# EasyEDA Pro project ProPrj_FireWheels_2025-05-12.epro, board PCB3
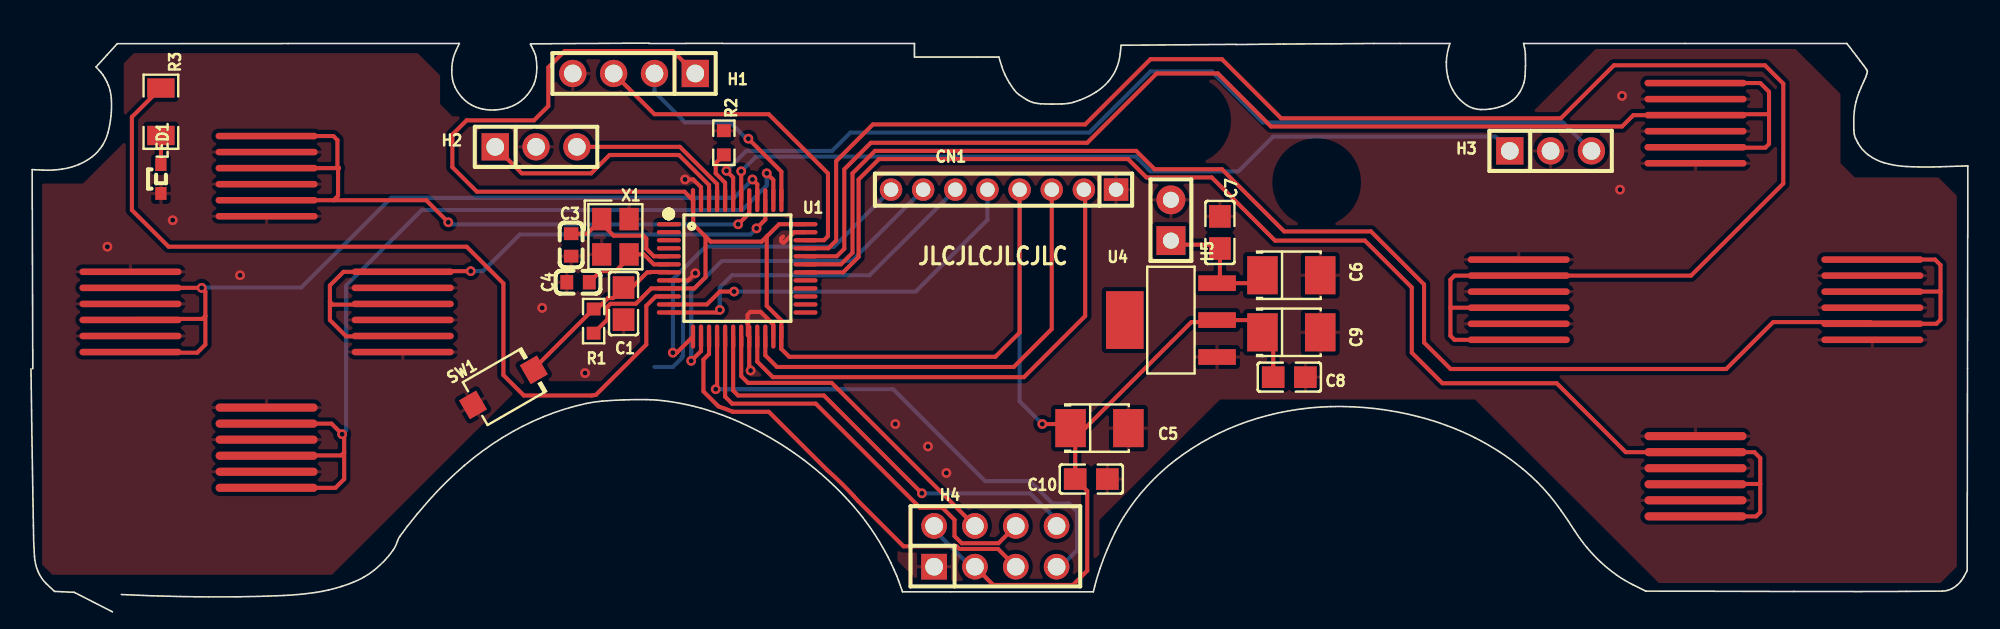
[diagram p5: board, top side]
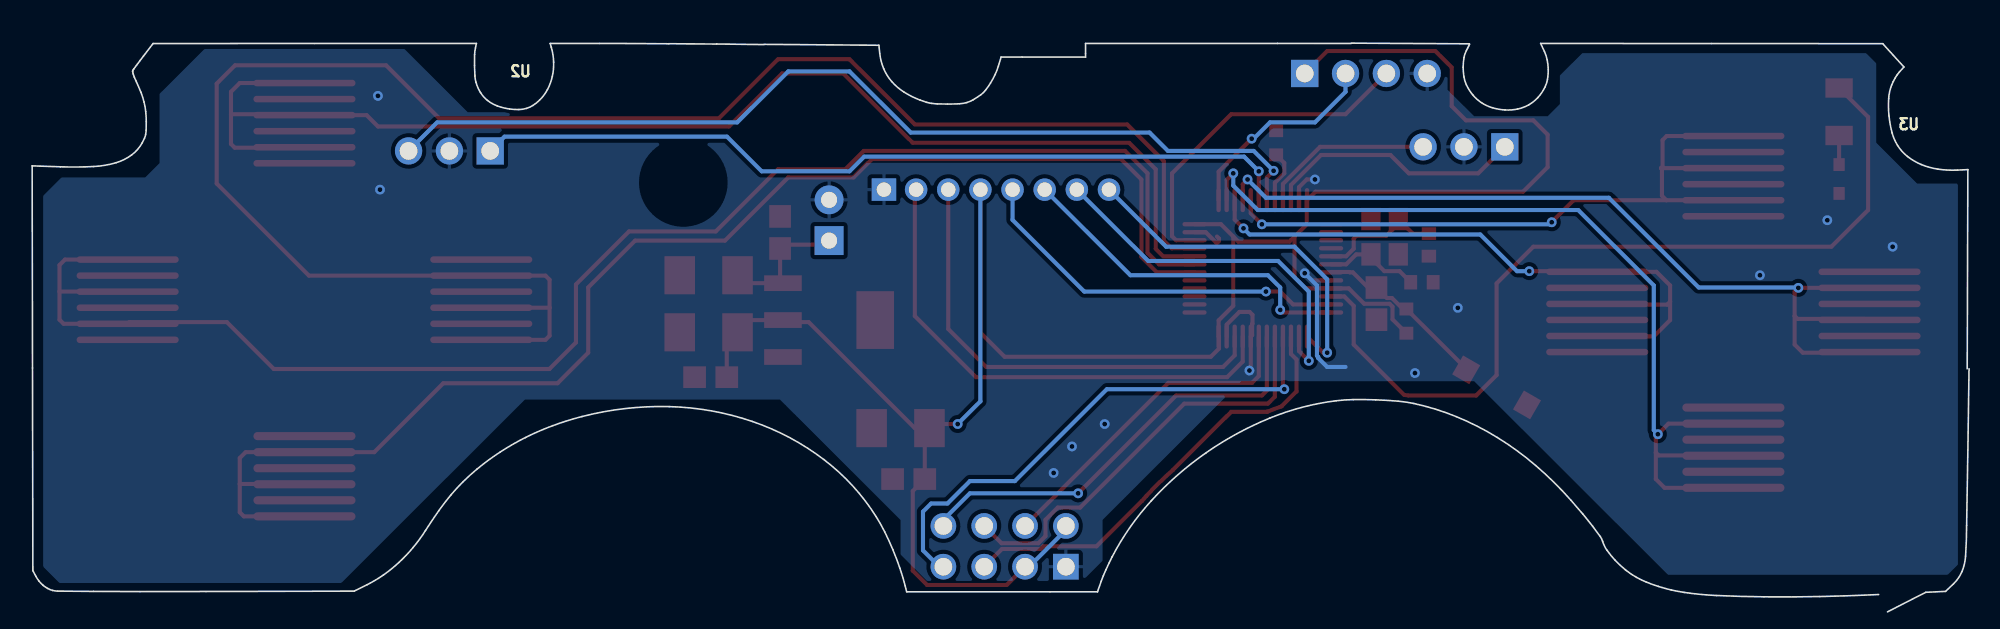
[diagram p6: board, bottom side, seen from below]

Outline 120.43 x 34.49 mm; copper layers: Top Layer, Bottom Layer. Coordinates in mm from the lower left corner of the outline.
Stack: Top Layer 0.035mm / Dielectric1 1.51mm FR4 er 4.5 / Bottom Layer 0.035mm

## Design rules (mm)
template: JLCPCB Capability(Two Layers Board)
spacing copperThickness1oz (default): track to track 0.102, other pairs 0.152 to 0.3
spacing copperThickness2oz: track to track 0.203, other pairs 0.152 to 0.3
track width copperThickness1oz (default): min 0.127, default 0.254, max 2.54
track width copperThickness2oz: min 0.203, default 0.254, max 2.54
differential pair differentialPair (default): width min 0.127, default 0.254, max 2.54; gap min 0.152, default 0.152
via viaSize (default): diameter min 0.5, default 0.61, max 10; hole min 0.3, default 0.305, max 6.3

## Placement (name value [footprint] x y rotation side)
C1  100nF  [C0805]  36.8 18.28 90 top
C3  20pF  [C0603]  33.53 21.93 90 top
C4  20pF  [C0603]  33.96 19.61 0 top
C5  22uF  [CAP-SMD_L3.5-W2.8-FD]  66.4 10.52 0 top
C6  22uF  [CAP-SMD_L3.5-W2.8-FD]  78.34 20.04 0 top
C7  100nF  [C0805]  73.9 22.71 270 top
C8  100nF  [C0805]  78.21 13.69 180 top
C9  22uF  [CAP-SMD_L3.5-W2.8-FD]  78.34 16.49 0 top
C10  100nF  [C0805]  65.89 7.34 0 top
CN1  HX PZ2.0-1x8P ZZ  [HDR-TH_8P-P2.00-V-M]  60.43 25.38 180 top
H1  -  [HDR-TH_4P-P2.54-V-M]  37.45 32.62 180 top
H2  -  [HDR-TH_3P-P2.54-V-M]  31.35 28.05 0 top
H3  -  [HDR-TH_3P-P2.54-V-M]  94.47 27.79 0 top
H4  -  [HDR-TH_8P-P2.54-V-F-R2-C4-S2.54-1]  59.93 3.15 0 top
H5  -  [HDR-TH_2P-P2.54-V-M-1]  70.85 23.47 90 top
LED1  27-21SURC/S530-A3/TR8  [LED-SMD_L1.7-W1.1-R-RD_RED]  8.01 26.04 90 top
R1  10kΩ  [R0603]  34.93 17.19 270 top
R2  10kΩ  [R0603]  43.03 28.3 270 top
R3  75Ω  [R1206]  8.01 30.23 270 top
SW1  -  [SW-SMD_L3.9-W3.0-P4.45]  29.32 13.06 30 top
U1  STM32F103C8T6  [LQFP-48_L7.0-W7.0-P0.50-LS9.0-BL]  43.86 20.47 270 top
U2  ABXY_Button_Pads  [ABXY_Button_Pads_MOD]  103.49 18.52 0 top
U3  DPAD_Button_Pads  [DPAD_Button_Pads_MOD]  14.59 17.76 0 top
U4  AMS1117-3.3  [SOT-223-3_L6.7-W3.7-P2.30-LS7.0-BR]  70.85 17.25 0 top
X1  8MHz  [CRYSTAL-SMD_4P-L3.2-W2.5-BL]  36.29 22.44 270 top

## Footprints (pads in the part's own frame, mm; a bottom-side part is the same pattern mirrored in y, then rotated)
ABXY_Button_Pads_MOD
  oval 6.35x0.508 smd: 1A(0,-8.5) 2A(0,-9.5) 3A(0,-10.5) 4A(0,-11.5) 5A(0,-12.5) 6A(0,-13.5)
  oval 6.35x0.406 smd: 1B(11,2.5) 1X(-11,2.5) 1Y(0,13.5) 2B(11,1.5) 2X(-11,1.5) 2Y(0,12.5) 3B(11,0.5) 3X(-11,0.5) 3Y(0,11.5) 4B(11,-0.5) 4X(-11,-0.5) 4Y(0,10.5) 5B(11,-1.5) 5X(-11,-1.5) 5Y(0,9.5) 6B(11,-2.5) 6X(-11,-2.5) 6Y(0,8.5)
C0603
  rect 0.8x0.9 smd: 1(-0.7,0) 2(0.7,0)
C0805
  rect 1.41x1.35 smd: 1(-1,0) 2(1,0)
CAP-SMD_L3.5-W2.8-FD
  rect 1.9x2.376 smd: 1(-1.798,0) 2(1.798,0)
CRYSTAL-SMD_4P-L3.2-W2.5-BL
  rect 1.4x1.2 smd: 1(-1.1,-0.85) 2(1.1,-0.85) 3(1.1,0.85) 4(-1.1,0.85)
DPAD_Button_Pads_MOD
  oval 6.35x0.508 smd: 1D(0,-5.96) 2D(0,-6.96) 3D(0,-7.96) 4D(0,-8.96) 5D(0,-9.96) 6D(0,-10.96)
  oval 6.35x0.406 smd: 1L(-8.47,2.5) 1R(8.47,2.5) 1U(0,10.96) 2L(-8.47,1.5) 2R(8.47,1.5) 2U(0,9.96) 3L(-8.47,0.5) 3R(8.47,0.5) 3U(0,8.96) 4L(-8.47,-0.5) 4R(8.47,-0.5) 4U(0,7.96) 5L(-8.47,-1.5) 5R(8.47,-1.5) 5U(0,6.96) 6L(-8.47,-2.5) 6R(8.47,-2.5) 6U(0,5.96)
HDR-TH_2P-P2.54-V-M-1
  rect 1.8x1.8 hole 1: 1(-1.27,0)
  round 1.8 hole 1: 2(1.27,0)
HDR-TH_3P-P2.54-V-M
  rect 1.7x1.7 hole 1.1: 1(-2.54,0)
  round 1.7 hole 1.1: 2(0,0) 3(2.54,0)
HDR-TH_4P-P2.54-V-M
  rect 1.7x1.7 hole 1.1: 1(-3.81,0)
  round 1.7 hole 1.1: 2(-1.27,0) 3(1.27,0) 4(3.81,0)
HDR-TH_8P-P2.00-V-M
  rect 1.524x1.4 hole 0.9: 1(-7,0)
  round 1.4 hole 0.9: 2(-5,0) 3(-3,0) 4(-1,0) 5(1,0) 6(3,0) 7(5,0) 8(7,0)
HDR-TH_8P-P2.54-V-F-R2-C4-S2.54-1
  rect 1.6x1.6 hole 1.1: 1(-3.81,-1.27)
  round 1.6 hole 1.1: 2(-3.81,1.27) 3(-1.27,-1.27) 4(-1.27,1.27) 5(1.27,-1.27) 6(1.27,1.27) 7(3.81,-1.27) 8(3.81,1.27)
LED-SMD_L1.7-W1.1-R-RD_RED
  rect 0.8x0.7 smd: 1(0.9,0) 2(-0.9,0)
LQFP-48_L7.0-W7.0-P0.50-LS9.0-BL
  oval 0.27x1.5 smd: 1(-2.75,-4.25) 2(-2.25,-4.25) 3(-1.75,-4.25) 4(-1.25,-4.25) 5(-0.75,-4.25) 6(-0.25,-4.25) 7(0.25,-4.25) 8(0.75,-4.25) 9(1.25,-4.25) 10(1.75,-4.25) 11(2.25,-4.25) 12(2.75,-4.25) 25(2.75,4.25) 26(2.25,4.25) 27(1.75,4.25) 28(1.25,4.25) 29(0.75,4.25) 30(0.25,4.25) 31(-0.25,4.25) 32(-0.75,4.25) 33(-1.25,4.25) 34(-1.75,4.25) 35(-2.25,4.25) 36(-2.75,4.25)
  oval 1.5x0.27 smd: 13(4.25,-2.75) 14(4.25,-2.25) 15(4.25,-1.75) 16(4.25,-1.25) 17(4.25,-0.75) 18(4.25,-0.25) 19(4.25,0.25) 20(4.25,0.75) 21(4.25,1.25) 22(4.25,1.75) 23(4.25,2.25) 24(4.25,2.75) 37(-4.25,2.75) 38(-4.25,2.25) 39(-4.25,1.75) 40(-4.25,1.25) 41(-4.25,0.75) 42(-4.25,0.25) 43(-4.25,-0.25) 44(-4.25,-0.75) 45(-4.25,-1.25) 46(-4.25,-1.75) 47(-4.25,-2.25) 48(-4.25,-2.75)
R0603
  rect 0.806x0.864 smd: 1(-0.753,0) 2(0.753,0)
R1206
  rect 1.208x1.701 smd: 1(-1.479,0) 2(1.479,0)
SOT-223-3_L6.7-W3.7-P2.30-LS7.0-BR
  rect 2.34x0.98 smd: 1(2.87,-2.3) 2(2.87,0) 3(2.87,2.3)
  rect 2.34x3.6 smd: 4(-2.87,0)
SW-SMD_L3.9-W3.0-P4.45
  rect 1.23x1.36 smd: 1(-2.185,0) 2(2.185,0)

## Nets
+5V: C6.1 C7.2 H5.1 U4.3
GND: C1.1 C3.1 C4.1 C5.2 C6.2 C7.1 C8.1 C9.2 C10.2 CN1.1 H1.4 H2.2 H3.2 H4.1 H5.2 LED1.2 R2.1 SW1.1 U1.8 U1.20 U1.23 U1.35 U1.47 U2.1A U2.1X U2.2B U2.2Y U2.3A U2.3X U2.4B U2.4Y U2.5A U2.5X U2.6B U2.6Y U3.1D U3.1L U3.2R U3.2U U3.3D U3.3L U3.4R U3.4U U3.5D U3.5L U3.6R U3.6U U4.1 X1.2 X1.4
VBAT: U1.1
VCC: C5.1 C8.2 C9.1 C10.1 CN1.4 H1.1 H4.2 H4.3 R1.2 U1.9 U1.24 U1.36 U1.48 U4.2
BA: U1.30 U2.2A U2.4A U2.6A
BB: U1.31 U2.1B U2.3B U2.5B
BX: U1.33 U2.2X U2.4X U2.6X
BY: U1.32 U2.1Y U2.3Y U2.5Y
CNS: H4.4 U1.19
DPD: U1.38 U3.2D U3.4D U3.6D
DPL: U1.40 U3.2L U3.4L U3.6L
DPR: U1.39 U3.1R U3.3R U3.5R
DPU: U1.41 U3.1U U3.3U U3.5U
IRQ: H4.8 U1.18
LAB: CN1.3 U1.22
LAX: CN1.5 U1.11
LAY: CN1.6 U1.12
LBMPR: H2.3 U1.45
LED: R3.1 U1.10
LTR: H2.1 U1.46
MISO: H4.7 U1.16
MOSI: H4.6 U1.17
OSCIN: C3.2 U1.5 X1.1
OSCOUT: C4.2 U1.6 X1.3
RAB: CN1.2 U1.21
RAX: CN1.7 U1.14
RAY: CN1.8 U1.13
RBMPR: H3.1 U1.42
RTR: H3.3 U1.43
SCK: H4.5 U1.15
SWDCLK: H1.2 U1.37
SWDIO: H1.3 U1.34
$1N975: R2.2 U1.44
$1N1012: C1.2 R1.1 SW1.2 U1.7
$1N3442: LED1.1 R3.2

Pads without a net: U1 2 3 4 25 26 27 28 29; U4 4

## Via types
v1: diameter 0.61, hole 0.305, Top Layer to Bottom Layer, 31 vias

## Routing (per net, layer and track width the routed paths; a pad name or vN(x,y) marks a point on that pad's centre or on a via; arc(x,y) is an arc through that point)
+5V: length 8.4
  Top Layer w0.254: 70.85,21.95 73.66,21.95 C7.2 73.9,19.73 U4.3 76.05,19.55 C6.1
GND: length 19.9
  Top Layer w0.254: U1.35 47.41,22.72 46.77,22.08 46.7,22.08 46.59,22.18 46.59,22.33 46.72,22.46 ; U1.23 46.12,16.97 45.32,17.76 44.69,17.76 44.51,17.58 44.51,17.03 44.53,17.01 44.53,16.31 U1.20 44.62,14.19 v1(44.7,14.11) ; U1.47 41.62,25.53 41.13,26.01 v1(40.62,26.01) ; v1(41.26,20.17) 40.81,19.72 U1.8
  Bottom Layer w0.254: 38.72,14.33 39.86,14.33 40.42,14.89 40.42,14.95 40.5,15.03 40.5,19.41 v1(41.26,20.17)
  vias: v1(4.68,21.82) v1(8.74,23.47) v1(12.94,20.04) v1(31.73,18.01) v1(34.4,13.95) v1(53.7,10.77) v1(55.73,9.38) v1(56.88,7.73) v1(98.79,25.38) v1(98.92,31.22)
VCC: length 145.8
  Top Layer w0.254: U1.36 46.47,23.23 45.7,22.46 ; C5.1 64.9,10.23 C10.1 65.64,6.6 65.64,1.63 64.75,0.75 59.8,0.75 H4.3 ; C5.1 65.52,10.52 72.12,17.12 73.59,17.12 U4.2 75.78,17.25 C9.1 77.22,15.82 C8.2 ; C5.1 64.35,10.77 v1(62.85,10.77) ; 41.89,22.46 41.13,23.22 41.13,24.71 U1.48 40.59,25.25 27.67,25.25 26.15,26.78 26.15,28.81 27.04,29.7 31.23,29.7 32.12,30.59 32.12,33 33.13,34.01 39.86,34.01 H1.1 ; 41.89,22.46 42.21,22.14 45.39,22.14 45.7,22.46 ; 41.89,22.46 41.89,19.92 41.2,19.23 U1.9 38.52,19.23 37.56,18.27 35.98,18.27 35.8,18.09 35.8,17.3 R1.2 ; CN1.4 61.44,16.47 59.93,14.96 47.1,14.96 46.59,15.47 46.59,16.2 U1.24 46.62,17.23 45.7,18.14 45.7,22.46
  Bottom Layer w0.254: CN1.4 61.43,12.19 v1(62.85,10.77) ; 56.12,4.17 58.66,1.63
BA: length 86.8
  Top Layer w0.254: U2.4A 103.51,7.04 107.52,7.04 ; U1.30 50.46,20.23 51.42,21.19 51.42,26.01 52.69,27.28 68.18,27.28 69.33,26.14 73.39,26.14 77.33,22.2 82.92,22.2 85.84,19.28 85.84,15.22 87.74,13.31 94.85,13.31 99.15,9.02 U2.2A 107.15,9.02 107.52,8.65 107.52,7.04 ; 107.52,7.04 107.52,5.27 107.26,5.02 U2.6A
BB: length 97.6
  Top Layer w0.254: U2.3B 114.5,19.03 118.73,19.03 ; 118.73,19.03 118.73,17.27 118.48,17.02 U2.5B 114.39,17.12 108.32,17.12 105.39,14.2 88.25,14.2 86.6,15.85 86.6,19.47 83.3,22.78 77.9,22.78 74.03,26.65 69.83,26.65 68.69,27.79 52.44,27.79 51.04,26.39 51.04,21.44 50.32,20.72 U1.31 ; 118.73,19.03 118.73,20.68 118.39,21.02 U2.1B
BX: length 113.5
  Top Layer w0.254: U2.6X 88.5,16.02 88.24,16.27 88.24,18.02 ; U1.33 49.54,21.72 50.02,22.2 50.02,27.16 52.31,29.44 65.52,29.44 69.58,33.51 74.03,33.51 77.71,29.82 95.11,29.82 98.41,33.13 107.81,33.13 108.95,31.98 108.95,25.76 103.21,20.02 U2.2X 88.5,20.02 88.24,19.77 88.24,18.02 ; 88.24,18.02 U2.4X
BY: length 82
  Top Layer w0.254: 108.06,30.08 108.06,31.47 107.52,32.02 U2.1Y ; 108.06,30.08 108.06,28.23 107.83,27.99 103.52,27.99 U2.5Y ; 108.06,30.08 103.55,30.08 U2.3Y 99.62,30.02 98.92,29.32 77.07,29.32 73.77,32.62 69.96,32.62 65.64,28.3 52.18,28.3 50.53,26.65 50.53,21.7 50.06,21.23 U1.32
CNS: length 20.9
  Top Layer w0.254: U1.19 44.12,13.76 44.54,13.34 49.74,13.34 58.66,4.42
DPD: length 57.7
  Top Layer w0.254: 14.84,10.8 18.63,10.8 19.42,10.01 19.42,9 ; v1(45.7,26.39) 46.12,25.98 U1.38 ; 19.42,9 19.42,7.34 18.87,6.8 14.84,6.8 ; 19.42,9 19.24,8.82 14.86,8.82 14.84,8.8
  Bottom Layer w0.254: v1(19.29,10.14) 19.54,10.39 19.54,19.41 24.24,24.11 44.18,24.11 45.7,25.63 v1(45.7,26.39)
DPL: length 55.3
  Top Layer w0.254: 6.41,15.22 10.27,15.22 10.78,15.73 10.78,17.5 ; v1(44.82,26.01) 45.12,25.71 U1.40 ; 6.37,19.26 v1(10.55,19.26) 10.78,19.03 10.78,17.5 ; 6.44,17.33 10.6,17.33 10.78,17.5
  Bottom Layer w0.254: 10.53,19.28 16.75,19.28 22.34,24.87 43.67,24.87 v1(44.82,26.01)
DPR: length 42.2
  Top Layer w0.254: v1(27.29,20.3) 23.1,20.3 U3.1R 19.38,20.26 18.53,19.41 18.53,18.39 ; v1(45.07,22.97) 45.62,23.51 U1.39 ; 23.27,18.21 18.71,18.21 18.53,18.39 ; 23.29,16.23 19.54,16.23 18.53,17.25 18.53,18.39
  Bottom Layer w0.254: v1(45.07,22.97) 44.69,22.58 30.34,22.58 28.05,20.3 v1(27.29,20.3)
DPU: length 43.9
  Top Layer w0.254: 19.09,26.72 14.84,26.72 ; 19.09,26.72 19,26.81 19,28.46 18.74,28.72 14.84,28.72 ; 19.09,26.72 19.03,26.66 19.03,25 18.76,24.72 ; 18.76,24.72 14.84,24.72 ; 18.76,24.72 24.52,24.72 v1(25.89,23.35) ; v1(43.93,23.22) 44.62,23.91 U1.41
  Bottom Layer w0.254: v1(43.92,23.22) 26.02,23.22 v1(25.89,23.35)
IRQ: length 27.2
  Top Layer w0.254: U1.18 43.61,12.86 43.92,12.55 49.26,12.55 v1(55.35,6.46)
  Bottom Layer w0.254: v1(55.36,6.46) 62.09,6.46 63.74,4.8 63.74,4.42
LAB: length 29
  Top Layer w0.254: CN1.3 63.44,16.69 61.07,14.33 46.34,14.33 45.62,15.05 U1.22
LAX: length 23.9
  Top Layer w0.254: v1(43.67,19.03) 42.78,19.03 41.98,18.23 U1.11
  Bottom Layer w0.254: CN1.5 59.44,23.49 54.98,19.03 v1(43.67,19.03)
LAY: length 21.8
  Top Layer w0.254: v1(42.78,17.89) 42.62,17.72 U1.12
  Bottom Layer w0.254: v1(42.78,17.89) 42.78,19.28 43.55,20.04 52.1,20.04 CN1.6
LBMPR: length 10.7
  Top Layer w0.254: H2.3 40.3,28.05 42.62,25.73 U1.45
LED: length 53.9
  Top Layer w0.254: U1.10 38.79,18.72 38.21,18.14 38.21,15.73 35.07,12.59 arc(34.94,12.57) 34.81,12.55 30.59,12.55 29.32,13.82 29.32,19.54 27.03,21.82 8.49,21.82 6.2,24.11 6.2,29.91 R3.1
LTR: length 16.2
  Top Layer w0.254: U1.46 42.12,25.67 40.24,27.54 35.93,27.54 34.78,26.39 30.46,26.39 H2.1
MISO: length 33.1
  Top Layer w0.254: U1.16 42.62,13.03 v1(42.53,12.94)
  Bottom Layer w0.254: v1(42.53,12.94) 53.57,12.94 59.29,7.22 62.09,7.22 63.48,5.82 64.5,5.82 65.01,5.31 65.01,2.9 63.99,1.88 H4.7
MOSI: length 26.7
  Top Layer w0.254: 61.2,4.42 60.12,3.34 57.83,3.34 57.39,3.79 57.39,4.8 56.63,5.57 55.23,5.57 48.75,12.04 43.55,12.04 43.12,12.48 U1.17
OSCIN: length 7.9
  Top Layer w0.254: 35.42,23.52 34.53,22.63 C3.2 ; 35.42,23.52 35.42,23.27 36.18,22.51 38.03,22.51 38.21,22.33 38.21,21.7 38.68,21.23 U1.5 ; 35.42,23.52 X1.1
OSCOUT: length 6.1
  Top Layer w0.254: U1.6 38.68,20.72 38.06,21.34 X1.3 37.14,21.13 36.3,20.3 35.35,20.3 C4.2
RAB: length 31.8
  Top Layer w0.254: U1.21 45.11,14.66 46.08,13.69 61.7,13.69 65.51,17.5 65.51,25.3 CN1.2
RAX: length 23.1
  Top Layer w0.254: U1.14 41.61,15.32 v1(41,14.71)
  Bottom Layer w0.254: v1(41.01,14.71) 41.01,19.03 42.91,20.93 50.99,20.93 CN1.7
RAY: length 22.1
  Top Layer w0.254: v1(39.86,15.22) 40.11,15.22 U1.13
  Bottom Layer w0.254: v1(39.86,15.22) 39.86,19.79 41.89,21.82 49.88,21.82 CN1.8
RBMPR: length 51.6
  Top Layer w0.254: v1(44.11,26.52) U1.42
  Bottom Layer w0.254: H3.1 91.04,28.68 77.2,28.68 75.04,26.52 69.58,26.52 68.67,27.44 45.03,27.44 v1(44.12,26.52)
RTR: length 60.4
  Top Layer w0.254: v1(43.19,26.55) 43.61,26.13 U1.43
  Bottom Layer w0.254: H3.3 95.23,29.57 76.56,29.57 73.39,32.74 69.58,32.74 65.77,28.93 50.91,28.93 49.77,27.79 44.43,27.79 v1(43.19,26.55)
SCK: length 27.4
  Top Layer w0.254: U1.15 42.11,15.14 41.77,14.79 41.77,12.81 42.7,11.87 arc(43.15,11.71) 43.59,11.54 arc(43.59,11.54) 43.59,11.54 45.83,11.54 49.47,7.9 arc(50.31,7.11) 51.11,6.29 arc(51.24,6.14) 51.38,5.99 54.21,3.15 57.52,3.15 57.68,2.99 60.09,2.99 H4.5
SWDCLK: length 12.9
  Top Layer w0.254: v1(44.56,28.55) 46.62,26.5 U1.37
  Bottom Layer w0.254: H1.2 38.72,31.47 40.62,29.57 43.42,29.57 44.43,28.55 v1(44.56,28.55)
SWDIO: length 21.3
  Top Layer w0.254: U1.34 49.26,22.23 49.51,22.48 49.51,26.39 45.83,30.08 38.72,30.08 36.18,32.62
$1N975: length 3.3
  Top Layer w0.254: U1.44 43.12,25.81 42.53,26.39 42.53,27.04 R2.2
$1N1012: length 11
  Top Layer w0.254: U1.7 39.59,20.25 38.47,20.25 38.45,20.23 38.26,20.23 37.31,19.28 C1.2 36.14,18.62 35.83,18.62 35.14,17.94 R1.1 31.21,14.22 31.21,14.15
$1N3442: length 1.8
  Top Layer w0.254: R3.2 LED1.1

## Copper pours and planes (outline as drawn; the poured copper is in the pictures)
GND on Top Layer: 1.25,1.38 18.65,1.38 30.72,13.44 45.19,13.44 53.83,4.8 53.83,2.26 55.1,0.99 64.75,0.99 66.4,2.65 66.4,4.8 73.9,12.29 73.9,12.3 89.77,12.3 101.2,0.87 118.73,0.87 119.74,1.88 119.74,25 118.6,26.14 113.39,26.14 112.5,27.03 112.5,31.35 109.71,34.14 97.26,34.14 93.33,30.2 86.98,30.2 86.98,32.49 85.58,33.89 68.56,33.89 68.18,33.51 68.18,32.74 65.39,29.95 62.08,29.95 59.29,32.74 53.58,32.74 52.81,33.51 32.75,33.51 32.37,33.89 32.37,31.6 30.72,29.95 26.14,29.95 25.38,30.71 25.38,32.49 23.98,33.89 6.33,33.89 5.7,33.25 5.7,28.3 3.16,25.76 0.62,25.76 0.62,2.01
GND on Bottom Layer: 1.25,1.38 18.65,1.38 30.72,13.44 45.19,13.44 53.83,4.8 53.83,2.26 55.1,0.99 64.75,0.99 66.4,2.65 66.4,4.8 73.9,12.29 73.9,12.3 89.77,12.3 101.2,0.87 118.73,0.87 119.74,1.88 119.74,25 118.6,26.14 113.39,26.14 112.5,27.03 112.5,31.35 109.71,34.14 97.26,34.14 93.33,30.2 86.98,30.2 86.98,32.49 85.58,33.89 68.56,33.89 68.18,33.51 68.18,32.74 65.39,29.95 62.08,29.95 59.29,32.74 53.58,32.74 52.81,33.51 32.75,33.51 32.37,33.89 32.37,31.6 30.72,29.95 26.14,29.95 25.38,30.71 25.38,32.49 23.98,33.89 6.33,33.89 5.7,33.25 5.7,28.3 3.16,25.76 0.62,25.76 0.62,2.01

## Text on the board
Top Silkscreen Layer: JLCJLCJLCJLC
